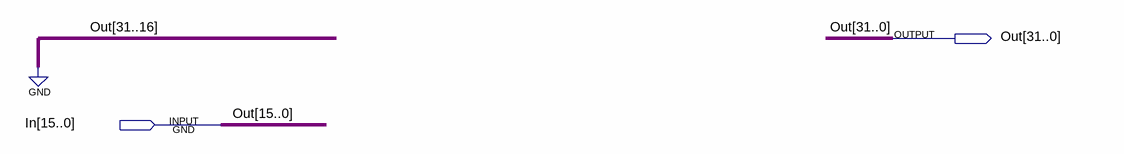
[diagram p0: schematic sheet]
// Quartus schematic UEZ.bdf as structural Verilog: 0 symbols, 2 pins
module UEZ (
  input  [15:0] In,
  output [31:0] Out
);


  assign Out = {{16{1'b0}}, In};
endmodule
